# EAGLE design multi-pcb-gps (EAGLE 9.6.2)
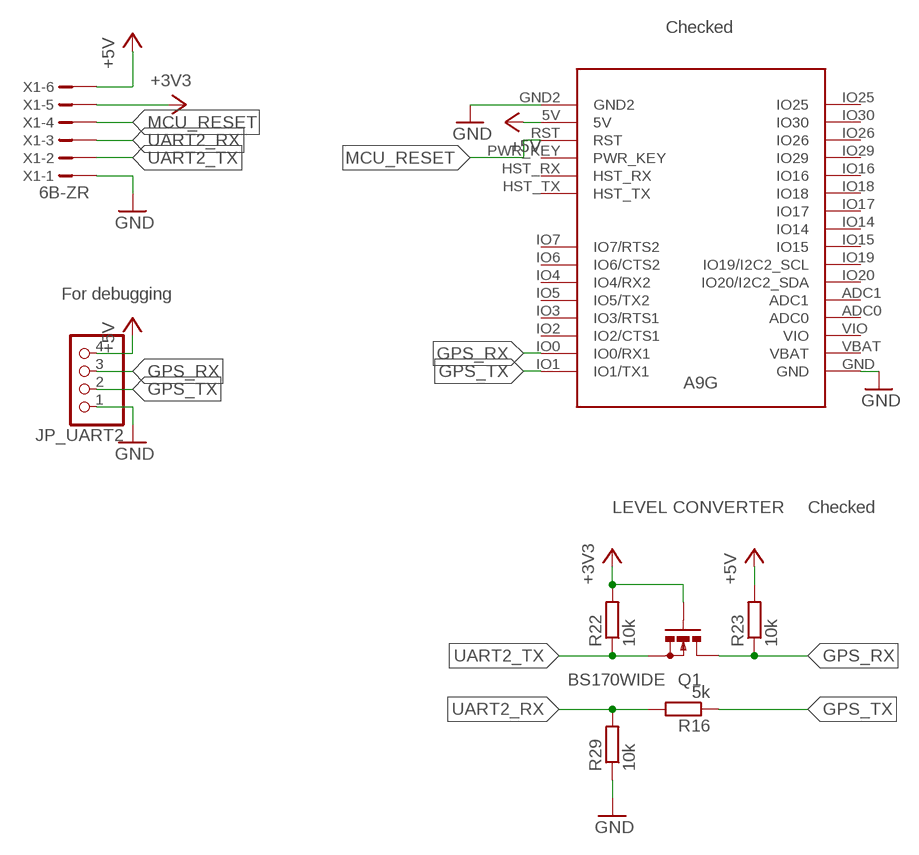
[diagram p0: schematic, sheet 1]

## Parts
JP_UART2  PINHD-1X4  [1X04]
Q1  BS170WIDE  [SOT54E2]
R16  5k  R-EU_0207/7  [0207/7]
R22  10k  R-EU_0207/7  [0207/7]
R23  10k  R-EU_0207/7  [0207/7]
R29  10k  R-EU_0207/7  [0207/7]
U$6  A9G  [A9G]
X1  6B-ZR  [B6B-ZR2.5]

## Nets
+3V3: Q1.G R22.2 X1.5
+5V: JP_UART2.4 R23.2 U$6.5V X1.6
GND: JP_UART2.1 R29.1 U$6.GND U$6.GND2 X1.1
GPS_RX: JP_UART2.3 Q1.D R23.1 U$6.IO0(IO0/RX1)
GPS_TX: JP_UART2.2 R16.1 U$6.IO1(IO1/TX1)
MCU_RESET: U$6.RST X1.4
UART2_RX: R16.2 R29.2 X1.3
UART2_TX: Q1.S R22.1 X1.2
Unconnected: U$6.ADC0 U$6.ADC1 U$6.HST_RX U$6.HST_TX U$6.IO2(IO2/CTS1) U$6.IO3(IO3/RTS1) U$6.IO4(IO4/RX2) U$6.IO5(IO5/TX2) U$6.IO6(IO6/CTS2) U$6.IO7(IO7/RTS2) U$6.IO14 U$6.IO15 U$6.IO16 U$6.IO17 U$6.IO18 U$6.IO19(IO19/I2C2_SCL) U$6.IO20(IO20/I2C2_SDA) U$6.IO25 U$6.IO26 U$6.IO29 U$6.IO30 U$6.PWR_KEY U$6.VBAT U$6.VIO

## Notes on the sheet
- Checked
- For debugging
- LEVEL CONVERTER | Checked

## Library data of the parts
JP_UART2 = pinhead:PINHD-1X4: PIN HEADER
Q1 = samuel:BS170: N-CHANNEL MOS FET
R16 R22 R23 R29 = rcl:R-EU_: RESISTOR, European symbol; SPICEPREFIX: R
U$6 = A9:A9G
X1 = con-jst-custom:?6B-ZR: ZH CONNECTOR 1.5 mm, 4 pin 1 row Source: http://www.jst.com .. eZH.pdf

## Board
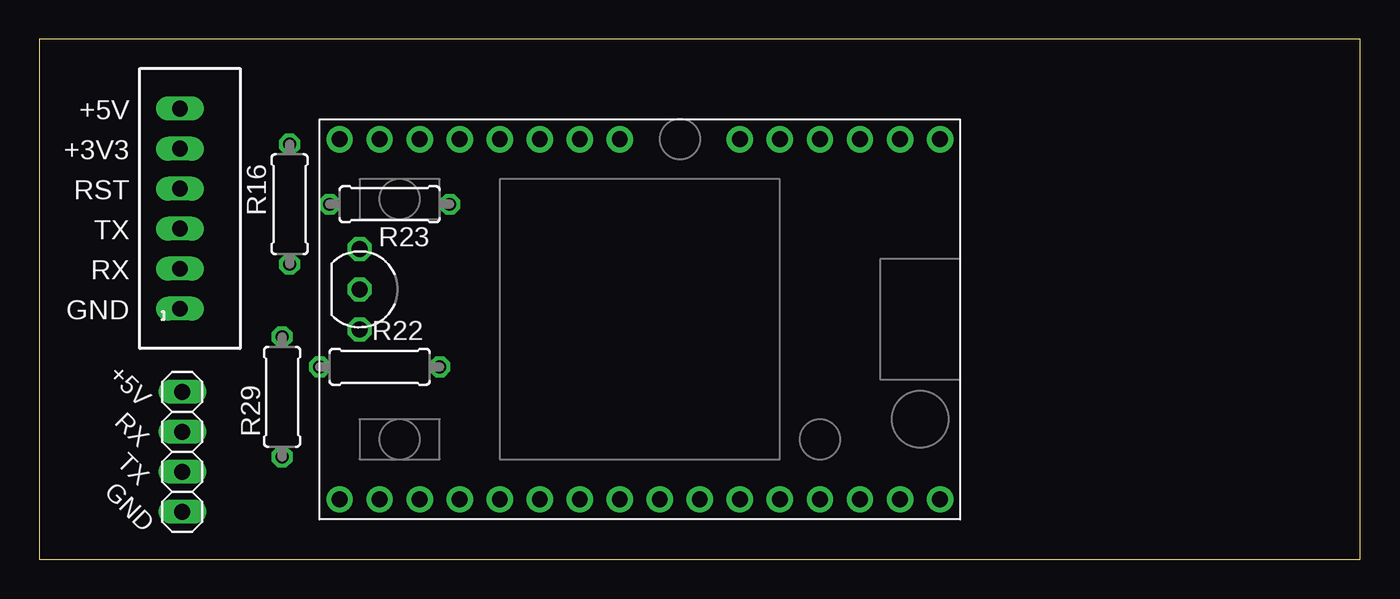
[diagram p1: board, top side]
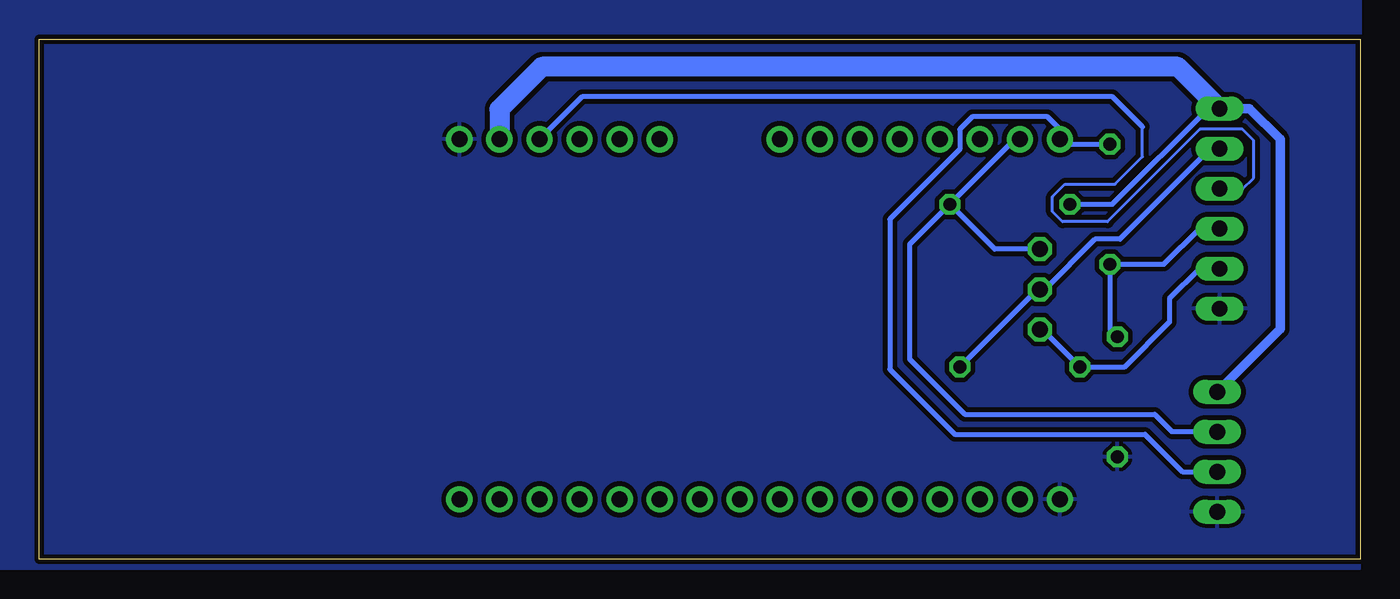
[diagram p2: board, bottom side, seen from below]

Size 83.81 x 33.01 mm. Coordinates in mm from the lower left corner, seen from the top.
Outline: 0,0 83.81,0 83.81,33.01 0,33.01 0,0
Copper layers (1*16): Top 0.035mm / dielectric 1.5mm / Bottom 0.035mm
Design rules "home-made-pcb": minimum track width 8mil, minimum drill 0.3mm, track to track 12mil, track to pad 8mil, pad to pad 10mil, via to via 10mil, smd to smd 6mil, copper to edge 8mil, drill to drill 10mil, minimum pad ring 10mil, minimum via ring 20mil, stop-mask expansion 4mil, vias tented up to drill 0mil, thermal gap 10mil

### Footprints (pad centres in the part's own frame; a part is rotated, then mirrored left to right if it is on the bottom)
1X04 = drill 1.016 long: 1 -3.81,0; 2 -1.27,0; 3 1.27,0; 4 3.81,0
SOT54E2 = drill 1.016 octagon: D -2.54,0; G 0,0; S 2.54,0
0207/7 = drill 0.813 octagon: 1 -3.81,0; 2 3.81,0
A9G = drill 1 pad 1.676: 5V -11.43,16.51; ADC0 11.43,-11.43; ADC1 11.43,-8.89; GND 11.43,-19.05; GND2 -11.43,19.05; HST_RX -11.43,8.89; HST_TX -11.43,6.35; IO0 -11.43,-16.51; IO1 -11.43,-19.05; IO2 -11.43,-13.97; IO3 -11.43,-11.43; IO4 -11.43,-6.35; IO5 -11.43,-8.89; IO6 -11.43,-3.81; IO7 -11.43,-1.27; IO14 11.43,1.27; IO15 11.43,-1.27; IO16 11.43,8.89; IO17 11.43,3.81; IO18 11.43,6.35; IO19 11.43,-3.81; IO20 11.43,-6.35; IO25 11.43,19.05; IO26 11.43,13.97; IO29 11.43,11.43; IO30 11.43,16.51; PWR_KEY -11.43,11.43; RST -11.43,13.97; VBAT 11.43,-16.51; VIO 11.43,-13.97
B6B-ZR2.5 = drill 1 pad 1.422 long: 1 -6.365,0; 2 -3.823,0; 3 -1.283,0; 4 1.257,0; 5 3.797,0; 6 6.337,0

### Placement (x,y rotation side)
JP_UART2  9.07,6.83 90 top
Q1  20.32,17.14 270 top
R16  15.88,22.54 270 top
R22  21.59,12.22 0 top
R23  22.23,22.54 180 top
R29  15.4,10.32 90 top
U$6  38.1,15.24 270 top
X1  8.92,22.28 90 top

### Tracks (layer width: path | path; a pad name or v marks a point on that pad's centre or on a via)
+3V3
  Bottom 0.305: X1.5 8.95,26.04 9.53,26.04 15.24,20.32 16.83,20.32 20,17.14 Q1.G 20.48,17.14 R22.2
+5V
  Bottom 0.305: R23.2 15.72,22.54 9.65,28.61 X1.6
  Bottom 0.61: JP_UART2.4 5.08,14.62 5.08,26.67 7.02,28.61 X1.6
  Bottom 1.27: X1.6 11.58,31.27 51.91,31.27 54.61,28.57 U$6.5V
GND
  pour Bottom (isolate 0.305): 0,41.91 92.71,41.91 92.71,-0.32 0,-0.32
  pour Bottom (isolate 0.305): 0,-0.64 93.34,-0.64 93.34,42.55 0,42.55
GPS_RX
  Bottom 0.305: R23.1 21.91,26.67 U$6.IO0 | JP_UART2.3 11.93,8.1 13.04,9.21 25.08,9.21 28.57,12.7 28.57,20 R23.1 | Q1.D 23.18,19.68 R23.1
GPS_TX
  Bottom 0.305: R16.1 18.73,26.35 U$6.IO1 19.05,27.3 19.84,28.1 24.61,28.1 25.4,27.3 25.4,26.04 29.84,21.59 29.84,12.06 25.72,7.94 13.65,7.94 11.27,5.56 JP_UART2.2
MCU_RESET
  Bottom 0.203: X1.4 7.5,23.53 7.46,23.5 6.75,24.21 6.75,26.59 7.46,27.3 10.16,27.3 16.03,21.43 18.89,21.43 19.53,22.07 19.53,23.02 18.73,23.81 15.56,23.81 13.81,25.56 13.81,27.46
  Bottom 0.305: 13.81,27.46 15.72,29.37 49.37,29.37 U$6.RST
UART2_RX
  Bottom 0.305: R29.2 15.88,14.61 R16.2 12.45,18.73 10.19,20.99 X1.3
UART2_TX
  Bottom 0.305: X1.2 10.19,18.45 12.09,16.55 12.09,15.06 14.92,12.22 R22.1 20.16,14.61 Q1.S

### Text on the board
tNames: +5V | +3V3 | RST | TX | RX | GND | +5V | RX | TX | GND